# Altium schematic sheet 如意硬件WIFI模块0831.SchDoc
size A4
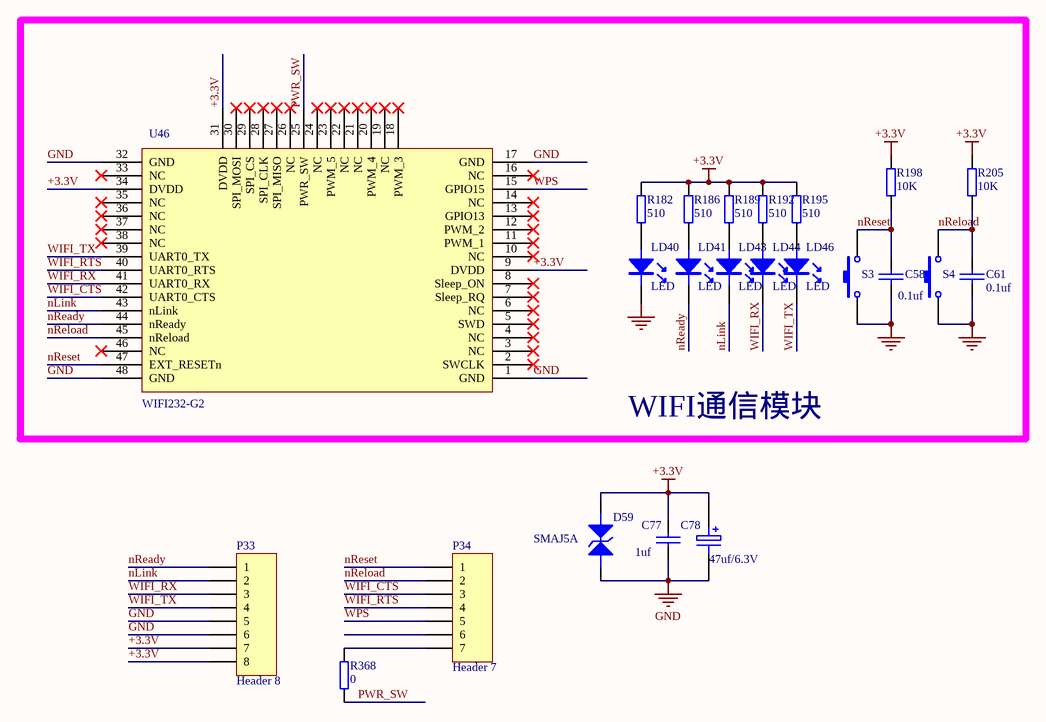
[diagram p0: 如意硬件WIFI模块0831.SchDoc]

## Parts
C58  0.1uf  [0603C-1]
C61  0.1uf  [0603C-1]
C77  1uf  [0603C-1]
C78  47uf/6.3V  [1206D-S]
D59  SMAJ5A  [SMB]
LD40  LED  [LED_Z1]
LD41  LED  [LED_Z1]
LD43  LED  [LED_Z1]
LD44  LED  [LED_Z1]
LD46  LED  [LED_Z1]
P33  Header 8  [HDR1X8]
P34  Header 7  [HDR1X7]
R182  510  [0603R-1]
R186  510  [0603R-1]
R189  510  [0603R-1]
R192  510  [0603R-1]
R195  510  [0603R-1]
R198  10K  [0603R-1]
R205  10K  [0603R-1]
R368  0  [0603R-1]
S3  SW-PB  [SW_PB4_A1]  (value not drawn)
S4  SW-PB  [SW_PB4_A1]  (value not drawn)
U46  WIFI232-G2  [USR-WIFI232-G2]

## Blocks framed on the sheet
WIFI通信模块: C58 C61 LD40 LD41 LD43 LD44 LD46 R182 R186 R189 R192 R195 R198 R205 S3 S4 U46

## Nets
+3.3V: C77.1 C78.1 D59.2(K) P33.7 P33.8 R182.1 R186.1 R189.1 R192.1 R195.1 R198.1 R205.1 U46.9(DVDD) U46.31(DVDD) U46.34(DVDD)
GND: C58.2 C61.2 C77.2 C78.2 D59.1(A) LD40.2 P33.5 P33.6 S3.1 S4.1 U46.1(GND) U46.17(GND) U46.32(GND) U46.48(GND)
nLink: LD43.2 P33.2 U46.43(nLink)
nReady: LD41.2 P33.1 U46.44(nReady)
nReload: C61.1 P34.2 R205.2 S4.2 U46.45(nReload)
nReset: C58.1 P34.1 R198.2 S3.2 U46.47(EXT_RESETn)
PWR_SW: R368.2 U46.25(PWR_SW)
WIFI_CTS: P34.3 U46.42(UART0_CTS)
WIFI_RTS: P34.4 U46.40(UART0_RTS)
WIFI_RX: LD44.2 P33.3 U46.41(UART0_RX)
WIFI_TX: LD46.2 P33.4 U46.39(UART0_TX)
WPS: P34.5 U46.15(GPIO15)
NetLD40_1: LD40.1 R182.2
NetLD41_1: LD41.1 R186.2
NetLD43_1: LD43.1 R189.2
NetLD44_1: LD44.1 R192.2
NetLD46_1: LD46.1 R195.2
NetP34_7: P34.7 R368.1

Not connected (* = marked no-connect by the designer): P34 6; U46 2(SWCLK)* 3(NC)* 4(NC)* 5(SWD)* 6(NC)* 7(Sleep_RQ)* 8(Sleep_ON)* 10(NC)* 11(PWM_1)* 12(PWM_2)* 13(GPIO13)* 14(NC)* 16(NC)* 18(PWM_3)* 19(NC)* 20(PWM_4)* 21(NC)* 22(NC)* 23(PWM_5)* 24(NC)* 26(NC)* 27(SPI_MISO)* 28(SPI_CLK)* 29(SPI_CS)* 30(SPI_MOSI)* 33(NC)* 35(NC)* 36(NC)* 37(NC)* 38(NC)* 46(NC)*

## Library data of the parts
C58 C61 C77 = CAP: Capacitor
C78 = ELECTRO1: Electrolytic Capacitor
D59 = TVS
P33 = Header 8: Header, 8-Pin; LatestRevisionDate: 17-Jul-2002; LatestRevisionNote: Re-released for DXP Platform.; Publisher: Altium Limited
P34 = Header 7: Header, 7-Pin; LatestRevisionDate: 17-Jul-2002; LatestRevisionNote: Re-released for DXP Platform.; Publisher: Altium Limited
R182 R186 R189 R192 R195 R198 R205 R368 = RES-2
S3 S4 = SW-PB: Switch; Published: 24-Mar-1999; LatestRevisionDate: 17-Jul-2002; LatestRevisionNote: Re-released for DXP Platform.; PackageReference: SPST-2; Publisher: Altium Limited